# EAGLE schematic compressor contro0l (EAGLE 9.6.2)
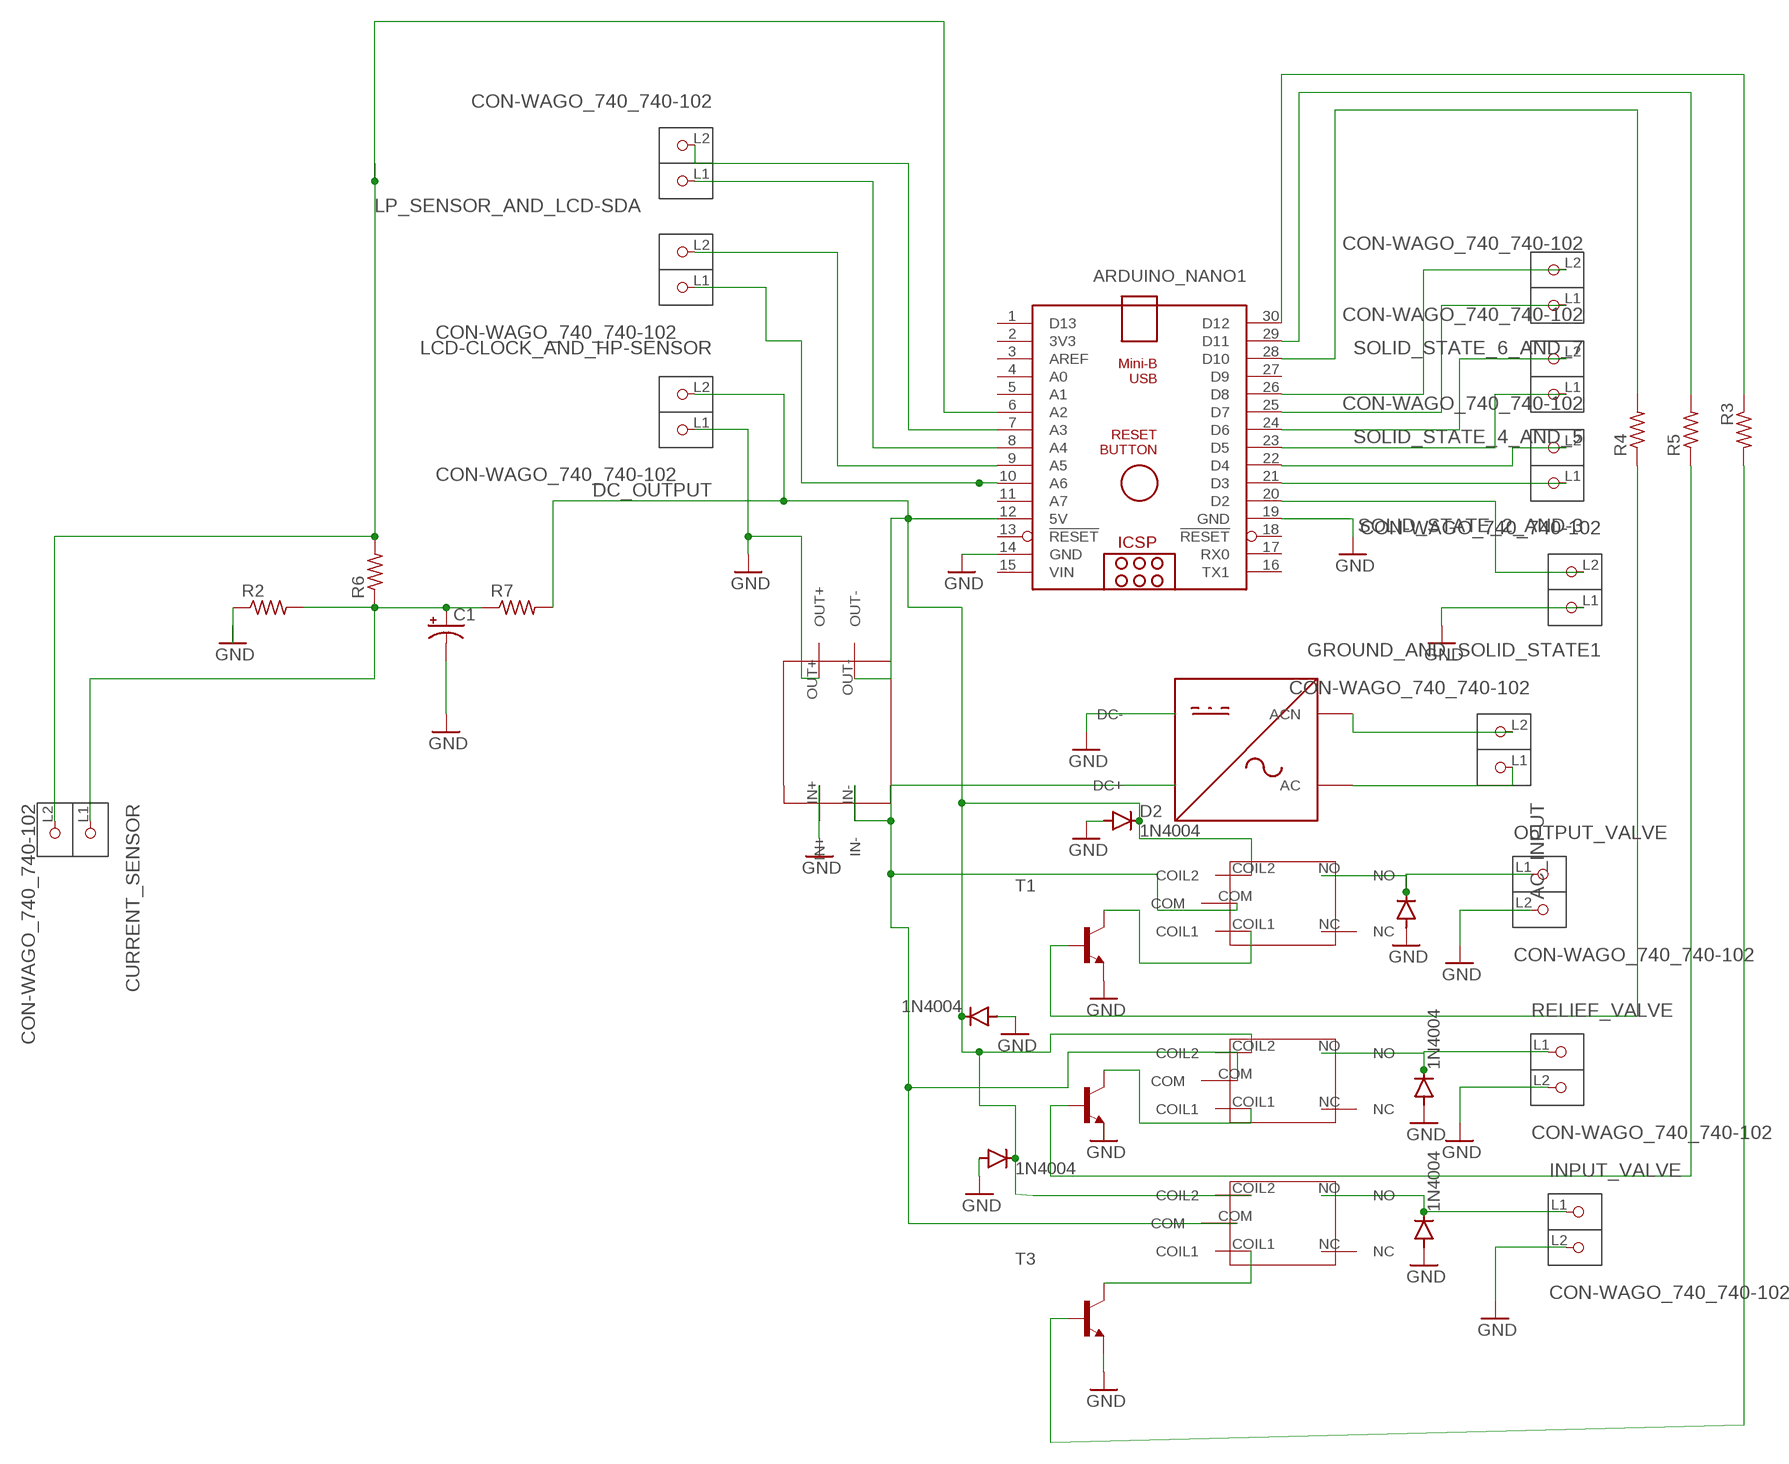
[diagram p0: schematic, sheet 1]

## Parts
AC-DC_12V-OUTPUT  RPD10W1S  [2343]
AC_INPUT  CON-WAGO_740_740-102  [CON-WAGO_740_P-740-102]
ARDUINO_NANO1  ARDUINONANOV30-GHIT_ARDUINO_NANO  [ARDUINONANOV30-GHIT_ARDUINO_NANO]
C1  CPOL-USE3.5-8  [E3,5-8]
CURRENT_SENSOR  CON-WAGO_740_740-102  [CON-WAGO_740_P-740-102]
D2  1N4004  [DO41-10]
D3  1N4004  [DO41-10]
D4  1N4004  [DO41-10]
D5  1N4004  [DO41-10]
D6  1N4004  [DO41-10]
D7  1N4004  [DO41-10]
DC-DC_BUCK-CONVERTOR  DC-DCBUCK  [DC-DCBUCK]
DC_OUTPUT  CON-WAGO_740_740-102  [CON-WAGO_740_P-740-102]
GROUND_AND_SOLID_STATE1  CON-WAGO_740_740-102  [CON-WAGO_740_P-740-102]
INPUT_VALVE  CON-WAGO_740_740-102  [CON-WAGO_740_P-740-102]
INTAKE-VALVE_RELAY  MRELAY2MRELAY2  [MRELAY]
LCD-CLOCK_AND_HP-SENSOR  CON-WAGO_740_740-102  [CON-WAGO_740_P-740-102]
LP_SENSOR_AND_LCD-SDA  CON-WAGO_740_740-102  [CON-WAGO_740_P-740-102]
OUTPUT-VALVE_RELAY  MRELAY2MRELAY2  [MRELAY]
OUTPUT_VALVE  CON-WAGO_740_740-102  [CON-WAGO_740_P-740-102]
R2  R-US_0207/10  [0207/10]
R3  R-US_0613/15  [P0613/15]
R4  R-US_0613/15  [P0613/15]
R5  R-US_0613/15  [P0613/15]
R6  R-US_0207/10  [0207/10]
R7  R-US_0207/10  [0207/10]
RELIEF-VALVE_RELAY  MRELAY2MRELAY2  [MRELAY]
RELIEF_VALVE  CON-WAGO_740_740-102  [CON-WAGO_740_P-740-102]
SOLID_STATE_2_AND-3  CON-WAGO_740_740-102  [CON-WAGO_740_P-740-102]
SOLID_STATE_4_AND_5  CON-WAGO_740_740-102  [CON-WAGO_740_P-740-102]
SOLID_STATE_6_AND_7  CON-WAGO_740_740-102  [CON-WAGO_740_P-740-102]
T1  2N2222-NPN-TO92-EBC  [TO92-EBC]
T2  2N2222-NPN-TO92-EBC  [TO92-EBC]
T3  2N2222-NPN-TO92-EBC  [TO92-EBC]

## Nets
GND: AC-DC_12V-OUTPUT.DC- ARDUINO_NANO1.14(GND) ARDUINO_NANO1.19(GND) C1.- D2.A D3.A D4.A D5.A D6.A D7.A DC-DC_BUCK-CONVERTOR.IN+ DC-DC_BUCK-CONVERTOR.OUT+ DC_OUTPUT.L1(P1) GROUND_AND_SOLID_STATE1.L1(P1) INPUT_VALVE.L2(P2) OUTPUT_VALVE.L2(P2) R2.1 RELIEF_VALVE.L2(P2) T1.E T2.E T3.E
N$1: ARDUINO_NANO1.9(A5) LCD-CLOCK_AND_HP-SENSOR.L2(P2)
N$2: ARDUINO_NANO1.20(D2) GROUND_AND_SOLID_STATE1.L2(P2)
N$3: ARDUINO_NANO1.21(D3) SOLID_STATE_2_AND-3.L1(P1)
N$4: ARDUINO_NANO1.22(D4) SOLID_STATE_2_AND-3.L2(P2)
N$5: ARDUINO_NANO1.23(D5) SOLID_STATE_4_AND_5.L1(P1)
N$6: ARDUINO_NANO1.24(D6) SOLID_STATE_4_AND_5.L2(P2)
N$7: ARDUINO_NANO1.30(D12) R3.1
N$8: ARDUINO_NANO1.25(D7) SOLID_STATE_6_AND_7.L1(P1)
N$10: ARDUINO_NANO1.10(A6) LCD-CLOCK_AND_HP-SENSOR.L1(P1)
N$11: AC-DC_12V-OUTPUT.ACN AC_INPUT.L2(P2)
N$12: ARDUINO_NANO1.8(A4) LP_SENSOR_AND_LCD-SDA.L1(P1)
N$13: AC-DC_12V-OUTPUT.AC AC_INPUT.L1(P1)
N$14: ARDUINO_NANO1.28(D10) R4.2
N$15: R4.1 T1.B
N$16: ARDUINO_NANO1.29(D11) R5.2
N$17: ARDUINO_NANO1.26(D8) SOLID_STATE_6_AND_7.L2(P2)
N$18: AC-DC_12V-OUTPUT.DC+ DC-DC_BUCK-CONVERTOR.IN- INTAKE-VALVE_RELAY.COM OUTPUT-VALVE_RELAY.COM RELIEF-VALVE_RELAY.COM
N$19: ARDUINO_NANO1.7(A3) LP_SENSOR_AND_LCD-SDA.L2(P2)
N$20: R3.2 T3.B
N$21: R5.1 T2.B
N$22: RELIEF-VALVE_RELAY.COIL1 T2.C
N$23: OUTPUT-VALVE_RELAY.COIL1 T1.C
N$24: INTAKE-VALVE_RELAY.COIL1 T3.C
N$25: ARDUINO_NANO1.12(5V) D2.C D4.C D5.C DC-DC_BUCK-CONVERTOR.OUT- DC_OUTPUT.L2(P2) INTAKE-VALVE_RELAY.COIL2 OUTPUT-VALVE_RELAY.COIL2 R7.2 RELIEF-VALVE_RELAY.COIL2
N$26: D7.C INPUT_VALVE.L1(P1) INTAKE-VALVE_RELAY.NO
N$27: D6.C OUTPUT-VALVE_RELAY.NO OUTPUT_VALVE.L1(P1)
N$29: D3.C RELIEF-VALVE_RELAY.NO RELIEF_VALVE.L1(P1)
N$32: ARDUINO_NANO1.6(A2) CURRENT_SENSOR.L2(P2) R6.2
N$33: C1.+ CURRENT_SENSOR.L1(P1) R2.2 R6.1 R7.1
Unconnected: ARDUINO_NANO1.1(D13) ARDUINO_NANO1.2(3V3) ARDUINO_NANO1.3(AREF) ARDUINO_NANO1.4(A0) ARDUINO_NANO1.5(A1) ARDUINO_NANO1.11(A7) ARDUINO_NANO1.13(!RESET) ARDUINO_NANO1.16(TX1) ARDUINO_NANO1.17(RX0) ARDUINO_NANO1.18(!RESET) ARDUINO_NANO1.27(D9) INTAKE-VALVE_RELAY.NC OUTPUT-VALVE_RELAY.NC RELIEF-VALVE_RELAY.NC

## Power pins joined to a net without a drawn wire
VIN: ARDUINO_NANO1.15(VIN)

## Library data of the parts
AC-DC_12V-OUTPUT = My_libray:RPD10W1S
AC_INPUT CURRENT_SENSOR DC_OUTPUT GROUND_AND_SOLID_STATE1 INPUT_VALVE LCD-CLOCK_AND_HP-SENSOR LP_SENSOR_AND_LCD-SDA OUTPUT_VALVE RELIEF_VALVE SOLID_STATE_2_AND-3 SOLID_STATE_4_AND_5 SOLID_STATE_6_AND_7 = Termnal block:CON-WAGO_740_740-102: Serie 740, Klemmenleiste für Leiterplatten 1 Lötstift/Pol / Series 740, PCB terminal strip 1 solder pin/pole Polzahl / Pole No.: 2 Rastermaß / Pitch: 5 mm Bemessungsspannung / Rated Voltage: 320 V Nennstrom / Nominal Current: 16 A Leiterquerschnitt / Conductor Size: 0.08 - 2.5 mm² Anschlusstechnik / Connection Technology: CAGE CLAMP® Lötstiftlänge: / Solder Pin Length: 5.1 mm Leitereinführung (zur Platine) / Conductor entry angle (to PCB): 0 ° Farbe / Color: grau / gray Stand: 01.01.2012. Die jeweils aktuellen Daten zu diesem Artikel finden Sie in unserem Produktkatalog, den Sie unter www.wago.com einsehen können. As of: 01/01/2012. Please find the newest data for this article in our product catalogue, which can be viewed under www.wago.com.
ARDUINO_NANO1 = Arduino Nano GHII:ARDUINONANOV30-GHIT_ARDUINO_NANO: Arduino Nano V3.0 Overview: The Arduino Nano is a small, complete, and breadboard-friendly board based on the ATmega328 (Arduino Nano 3.x) or ATmega168 (Arduino Nano 2.x). It has more or less the same functionality of the Arduino Duemilanove, but in a different package. It lacks only a DC power jack, and works with a Mini-B USB cable instead of a standard one. The Nano was designed and is being produced by Gravitech. Specifications: Microcontroller Atmel ATmega168 or ATmega328 Operating Voltage (logic level) 5 V Input Voltage (recommended) 7-12 V Input Voltage (limits) 6-20 V Digital I/O Pins 14 (of which 6 provide PWM output) Analog Input Pins 8 DC Current per I/O Pin 40 mA Flash Memory 16 KB (ATmega168) or 32 KB (ATmega328) of which 2 KB used by bootloader SRAM 1 KB (ATmega168) or 2 KB (ATmega328) EEPROM 512 bytes (ATmega168) or 1 KB (ATmega328) Clock Speed 16 MHz Dimensions 0.73" x 1.70" Length 45 mm Width 18 mm Weigth 5 g Power: The Arduino Nano can be powered via the Mini-B USB connection, 6-20V unregulated external power supply (pin 30), or 5V regulated external power supply (pin 27). The power source is automatically selected to the highest voltage source. Memory: The ATmega168 has 16 KB of flash memory for storing code (of which 2 KB is used for the bootloader); the ATmega328 has 32 KB, (also with 2 KB used for the bootloader). The ATmega168 has 1 KB of SRAM and 512 bytes of EEPROM (which can be read and written with the EEPROM library); the ATmega328 has 2 KB of SRAM and 1 KB of EEPROM. Input and Output: Each of the 14 digital pins on the Nano can be used as an input or output, using pinMode(), digitalWrite(), and digitalRead() functions. They operate at 5 volts. Each pin can provide or receive a maximum of 40 mA and has an internal pull-up resistor (disconnected by default) of 20-50 kOhms. In addition, some pins have specialized functions. Visit Arduino - ArduinoBoardNano <https://www.arduino.cc/en/Main/ArduinoBoardNano>
C1 = adafruit:CPOL-US: POLARIZED CAPACITOR, American symbol
D2-D7 = diode:1N4004: DIODE general purpose rectifier, 1 A
DC-DC_BUCK-CONVERTOR = dc-dcbuck:DC-DCBUCK: steps down voltage
INTAKE-VALVE_RELAY OUTPUT-VALVE_RELAY RELIEF-VALVE_RELAY = mrelay:MRELAY2: 5pin relay
R2 R6 R7 = rcl:R-US_: RESISTOR, American symbol; SPICEPREFIX: R
R3-R5 = adafruit:R-US_: RESISTOR, American symbol
T1-T3 = transistor-neu-to92:*-NPN-: NPN Transistror

## Net classes
0 default: width 1.499 mm, drill 0.762 mm, clearance 0.635 mm